# EAGLE design reversator (EAGLE 6.4)
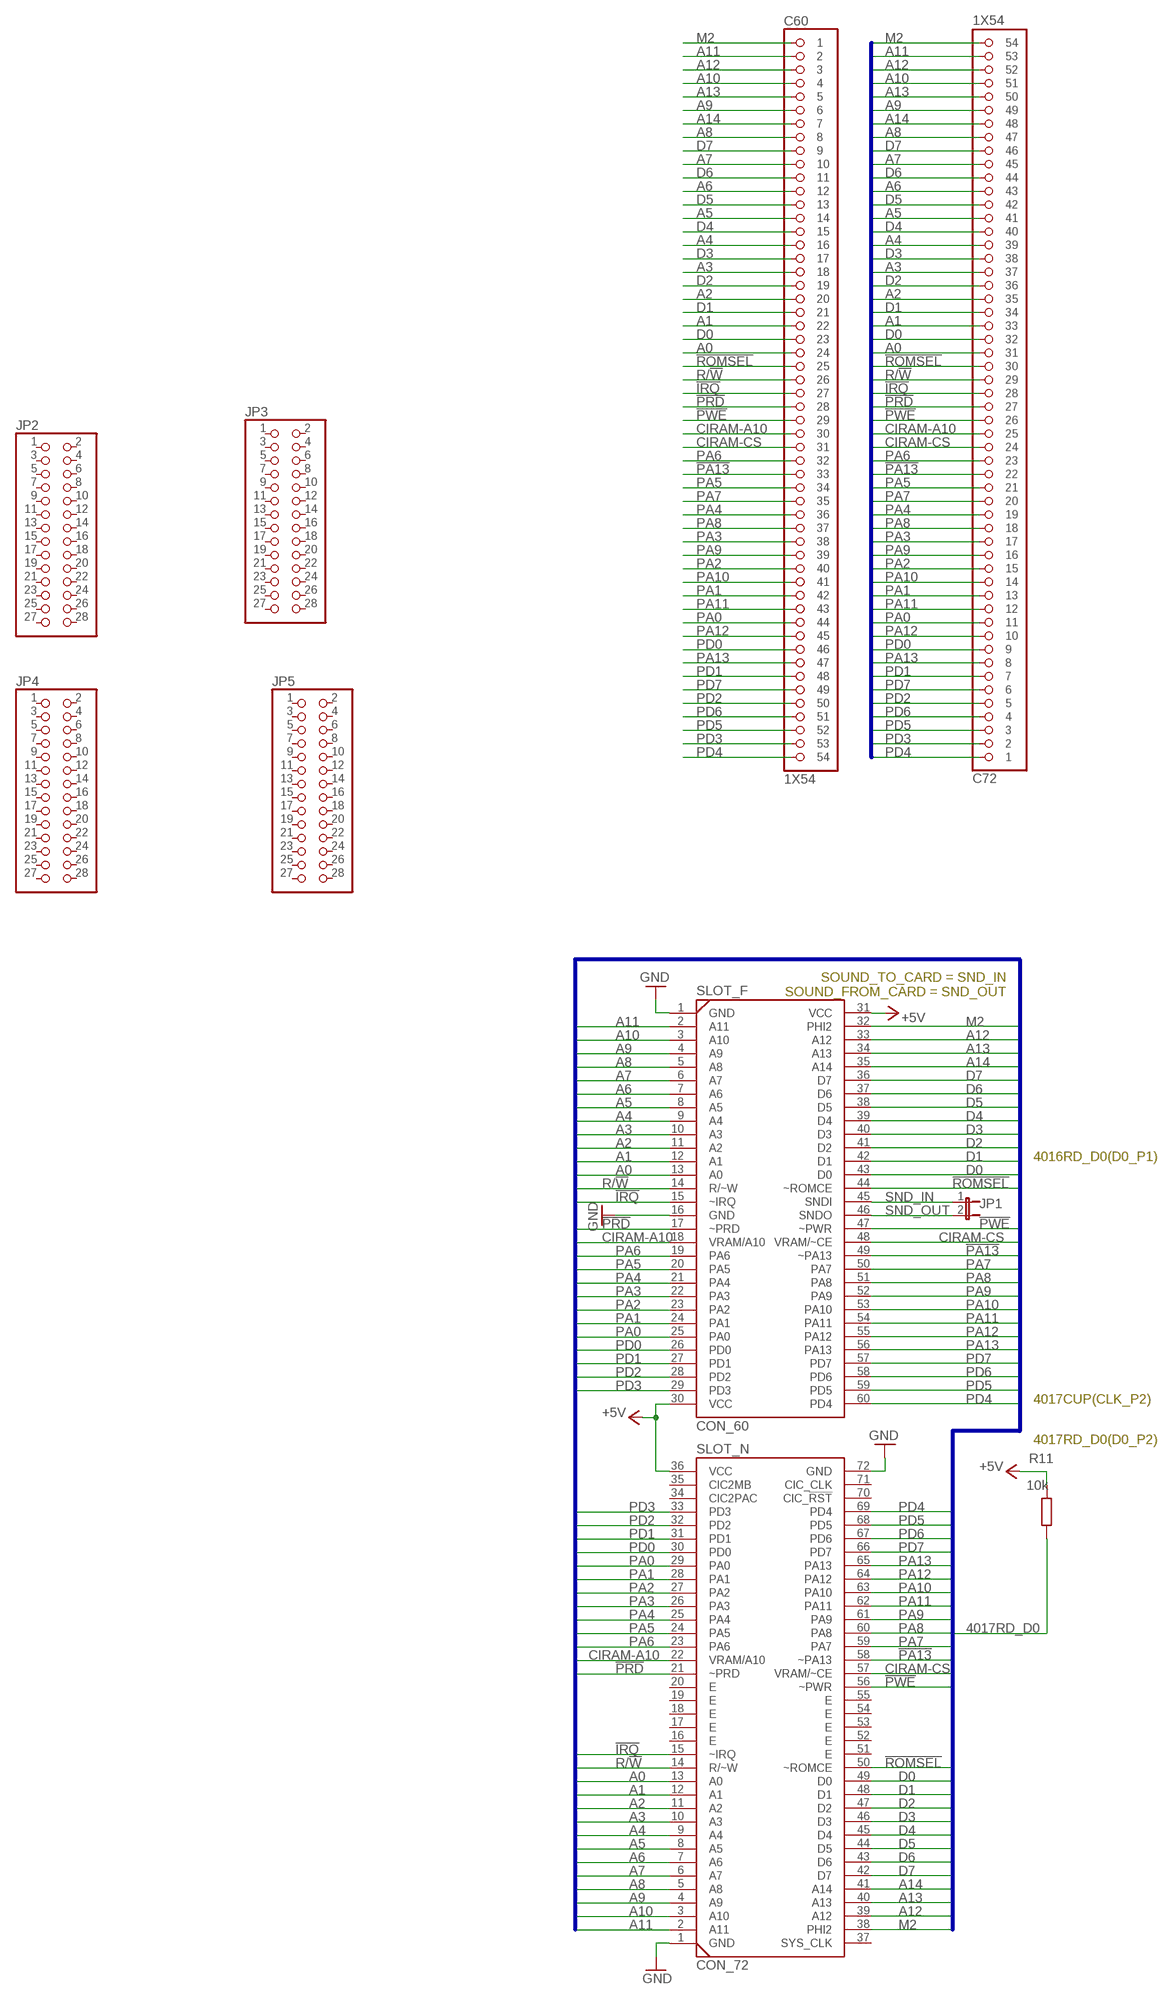
[diagram p0: schematic, sheet 1]

## Parts
C60  1X54  [1X54]
C72  1X54  [1X54]
JP1  JP1E  [JP1]
JP2  PINHD-2X14  [2X14]
JP3  PINHD-2X14  [2X14]
JP4  PINHD-2X14  [2X14]
JP5  PINHD-2X14  [2X14]
R11  10k  R-EU_M0805  [M0805]
SLOT_F  CON_60  [CON_60]
SLOT_N  CON_72  [CON_72]

## Nets
4017RD_D0: R11.2
!IRQ: C60.P$27 C72.P$28 SLOT_F.15(~IRQ) SLOT_N.15(~IRQ)
!PA13: C60.P$33 C72.P$22 SLOT_F.49(~PA13) SLOT_N.58(~PA13)
!PRD: C60.P$28 C72.P$27 SLOT_F.17(~PRD) SLOT_N.21(~PRD)
!PWE: C60.P$29 C72.P$26 SLOT_F.47(~PWR) SLOT_N.56(~PWR)
!ROMSEL: C60.P$25 C72.P$30 SLOT_F.44(~ROMCE) SLOT_N.50(~ROMCE)
+5V: R11.1 SLOT_F.30(VCC) SLOT_F.31(VCC) SLOT_N.36(VCC)
A0: C60.P$24 C72.P$31 SLOT_F.13(A0) SLOT_N.13(A0)
A1: C60.P$22 C72.P$33 SLOT_F.12(A1) SLOT_N.12(A1)
A2: C60.P$20 C72.P$35 SLOT_F.11(A2) SLOT_N.11(A2)
A3: C60.P$18 C72.P$37 SLOT_F.10(A3) SLOT_N.10(A3)
A4: C60.P$16 C72.P$39 SLOT_F.9(A4) SLOT_N.9(A4)
A5: C60.P$14 C72.P$41 SLOT_F.8(A5) SLOT_N.8(A5)
A6: C60.P$12 C72.P$43 SLOT_F.7(A6) SLOT_N.7(A6)
A7: C60.P$10 C72.P$45 SLOT_F.6(A7) SLOT_N.6(A7)
A8: C60.P$8 C72.P$47 SLOT_F.5(A8) SLOT_N.5(A8)
A9: C60.P$6 C72.P$49 SLOT_F.4(A9) SLOT_N.4(A9)
A10: C60.P$4 C72.P$51 SLOT_F.3(A10) SLOT_N.3(A10)
A11: C60.P$2 C72.P$53 SLOT_F.2(A11) SLOT_N.2(A11)
A12: C60.P$3 C72.P$52 SLOT_F.33(A12) SLOT_N.39(A12)
A13: C60.P$5 C72.P$50 SLOT_F.34(A13) SLOT_N.40(A13)
A14: C60.P$7 C72.P$48 SLOT_F.35(A14) SLOT_N.41(A14)
CIRAM-A10: C60.P$30 C72.P$25 SLOT_F.18(VRAM/A10) SLOT_N.22(VRAM/A10)
CIRAM-CS: C60.P$31 C72.P$24 SLOT_F.48(VRAM/~CE) SLOT_N.57(VRAM/~CE)
D0: C60.P$23 C72.P$32 SLOT_F.43(D0) SLOT_N.49(D0)
D1: C60.P$21 C72.P$34 SLOT_F.42(D1) SLOT_N.48(D1)
D2: C60.P$19 C72.P$36 SLOT_F.41(D2) SLOT_N.47(D2)
D3: C60.P$17 C72.P$38 SLOT_F.40(D3) SLOT_N.46(D3)
D4: C60.P$15 C72.P$40 SLOT_F.39(D4) SLOT_N.45(D4)
D5: C60.P$13 C72.P$42 SLOT_F.38(D5) SLOT_N.44(D5)
D6: C60.P$11 C72.P$44 SLOT_F.37(D6) SLOT_N.43(D6)
D7: C60.P$9 C72.P$46 SLOT_F.36(D7) SLOT_N.42(D7)
GND: SLOT_F.1(GND) SLOT_F.16(GND) SLOT_N.1(GND) SLOT_N.72(GND)
M2: C60.P$1 C72.P$54 SLOT_F.32(PHI2) SLOT_N.38(PHI2)
PA0: C60.P$44 C72.P$11 SLOT_F.25(PA0) SLOT_N.29(PA0)
PA1: C60.P$42 C72.P$13 SLOT_F.24(PA1) SLOT_N.28(PA1)
PA2: C60.P$40 C72.P$15 SLOT_F.23(PA2) SLOT_N.27(PA2)
PA3: C60.P$38 C72.P$17 SLOT_F.22(PA3) SLOT_N.26(PA3)
PA4: C60.P$36 C72.P$19 SLOT_F.21(PA4) SLOT_N.25(PA4)
PA5: C60.P$34 C72.P$21 SLOT_F.20(PA5) SLOT_N.24(PA5)
PA6: C60.P$32 C72.P$23 SLOT_F.19(PA6) SLOT_N.23(PA6)
PA7: C60.P$35 C72.P$20 SLOT_F.50(PA7) SLOT_N.59(PA7)
PA8: C60.P$37 C72.P$18 SLOT_F.51(PA8) SLOT_N.60(PA8)
PA9: C60.P$39 C72.P$16 SLOT_F.52(PA9) SLOT_N.61(PA9)
PA10: C60.P$41 C72.P$14 SLOT_F.53(PA10) SLOT_N.63(PA10)
PA11: C60.P$43 C72.P$12 SLOT_F.54(PA11) SLOT_N.62(PA11)
PA12: C60.P$45 C72.P$10 SLOT_F.55(PA12) SLOT_N.64(PA12)
PA13: C60.P$47 C72.P$8 SLOT_F.56(PA13) SLOT_N.65(PA13)
PD0: C60.P$46 C72.P$9 SLOT_F.26(PD0) SLOT_N.30(PD0)
PD1: C60.P$48 C72.P$7 SLOT_F.27(PD1) SLOT_N.31(PD1)
PD2: C60.P$50 C72.P$5 SLOT_F.28(PD2) SLOT_N.32(PD2)
PD3: C60.P$53 C72.P$2 SLOT_F.29(PD3) SLOT_N.33(PD3)
PD4: C60.P$54 C72.P$1 SLOT_F.60(PD4) SLOT_N.69(PD4)
PD5: C60.P$52 C72.P$3 SLOT_F.59(PD5) SLOT_N.68(PD5)
PD6: C60.P$51 C72.P$4 SLOT_F.58(PD6) SLOT_N.67(PD6)
PD7: C60.P$49 C72.P$6 SLOT_F.57(PD7) SLOT_N.66(PD7)
R/!W: C60.P$26 C72.P$29 SLOT_F.14(R/~W) SLOT_N.14(R/~W)
SND_IN: JP1.1 SLOT_F.45(SNDI)
SND_OUT: JP1.2 SLOT_F.46(SNDO)
Unconnected: JP2.1 JP2.2 JP2.3 JP2.4 JP2.5 JP2.6 JP2.7 JP2.8 JP2.9 JP2.10 JP2.11 JP2.12 JP2.13 JP2.14 JP2.15 JP2.16 JP2.17 JP2.18 JP2.19 JP2.20 JP2.21 JP2.22 JP2.23 JP2.24 JP2.25 JP2.26 JP2.27 JP2.28 JP3.1 JP3.2 JP3.3 JP3.4 JP3.5 JP3.6 JP3.7 JP3.8 JP3.9 JP3.10 JP3.11 JP3.12 JP3.13 JP3.14 JP3.15 JP3.16 JP3.17 JP3.18 JP3.19 JP3.20 JP3.21 JP3.22 JP3.23 JP3.24 JP3.25 JP3.26 JP3.27 JP3.28 JP4.1 JP4.2 JP4.3 JP4.4 JP4.5 JP4.6 JP4.7 JP4.8 JP4.9 JP4.10 JP4.11 JP4.12 JP4.13 JP4.14 JP4.15 JP4.16 JP4.17 JP4.18 JP4.19 JP4.20 JP4.21 JP4.22 JP4.23 JP4.24 JP4.25 JP4.26 JP4.27 JP4.28 JP5.1 JP5.2 JP5.3 JP5.4 JP5.5 JP5.6 JP5.7 JP5.8 JP5.9 JP5.10 JP5.11 JP5.12 JP5.13 JP5.14 JP5.15 JP5.16 JP5.17 JP5.18 JP5.19 JP5.20 JP5.21 JP5.22 JP5.23 JP5.24 JP5.25 JP5.26 JP5.27 JP5.28 SLOT_N.16(E) SLOT_N.17(E) SLOT_N.18(E) SLOT_N.19(E) SLOT_N.20(E) SLOT_N.34(CIC2PAC) SLOT_N.35(CIC2MB) SLOT_N.37(SYS_CLK) SLOT_N.51(E) SLOT_N.52(E) SLOT_N.53(E) SLOT_N.54(E) SLOT_N.55(E) SLOT_N.70(CIC_!RST) SLOT_N.71(CIC_CLK)

## Buses
A[0..15],D[0..7],PA[0..13],!PA13,PD[0..7],CLK21,CLK26,CLK_P21,CLK_P26,CIRAM-A10,CIRAM-CS,!IRQ,M2,!NMI,PALE,!PPU,!PRD,!PWE,!RAM,!ROMSEL,R/!W,!RST21,!RST26,!RST_P21,!RST_P26,4016CUP,4016RD_!OE,4016WR_B[0..2],4016RD_D[0..4],4017CUP,4017RD_!OE,4017RD_D[0..4],VIDEO21,VIDEO26,MIC,SND_IN,SND_OUT,SOUND21_[1..2],SOUND21,SOUND26_[1..2],SOUND26

## Notes on the sheet
- SOUND_TO_CARD = SND_IN
  SOUND_FROM_CARD = SND_OUT
- 4016RD_D0(D0_P1)
- 4017CUP(CLK_P2)
- 4017RD_D0(D0_P2)

## Library data of the parts
C60 C72 = h1,27mm:1X54
JP1 = jumper:JP1E: JUMPER
JP2-JP5 = Разъёмы штырьковые 2.54мм:PINHD-2X14: PIN HEADER
R11 = rcl:R-EU_: RESISTOR, European symbol
SLOT_F = con_nes:CON_60
SLOT_N = fc-nes:CON_72

## Board
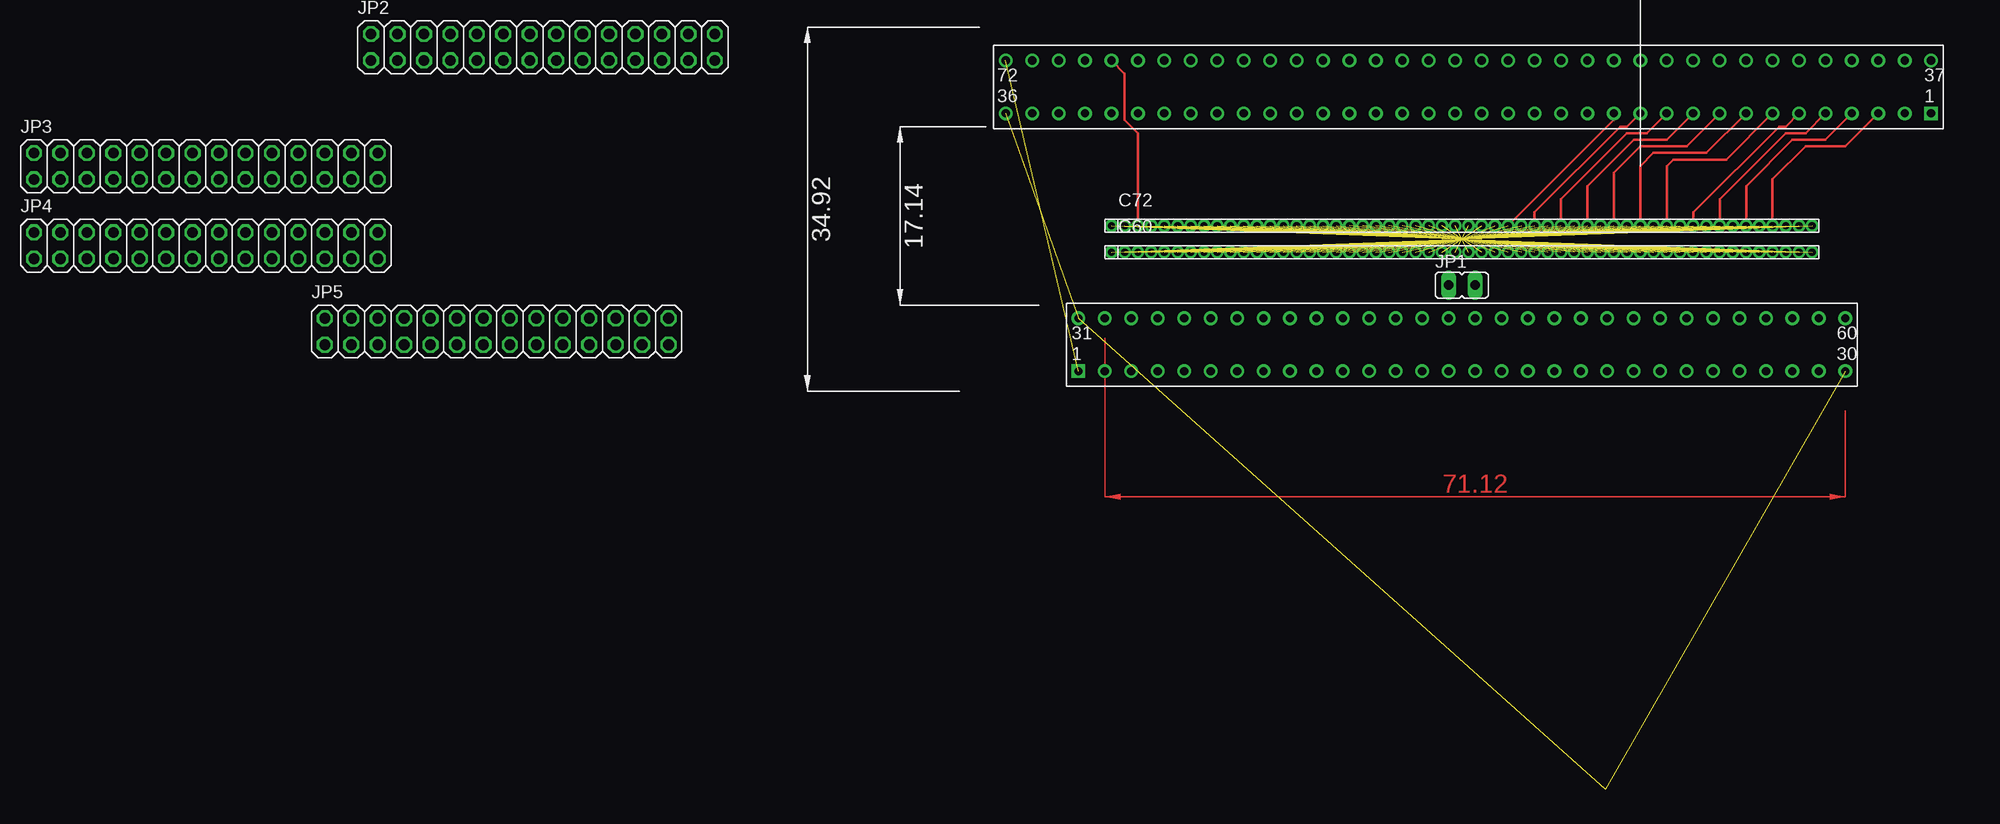
[diagram p1: board, top side]
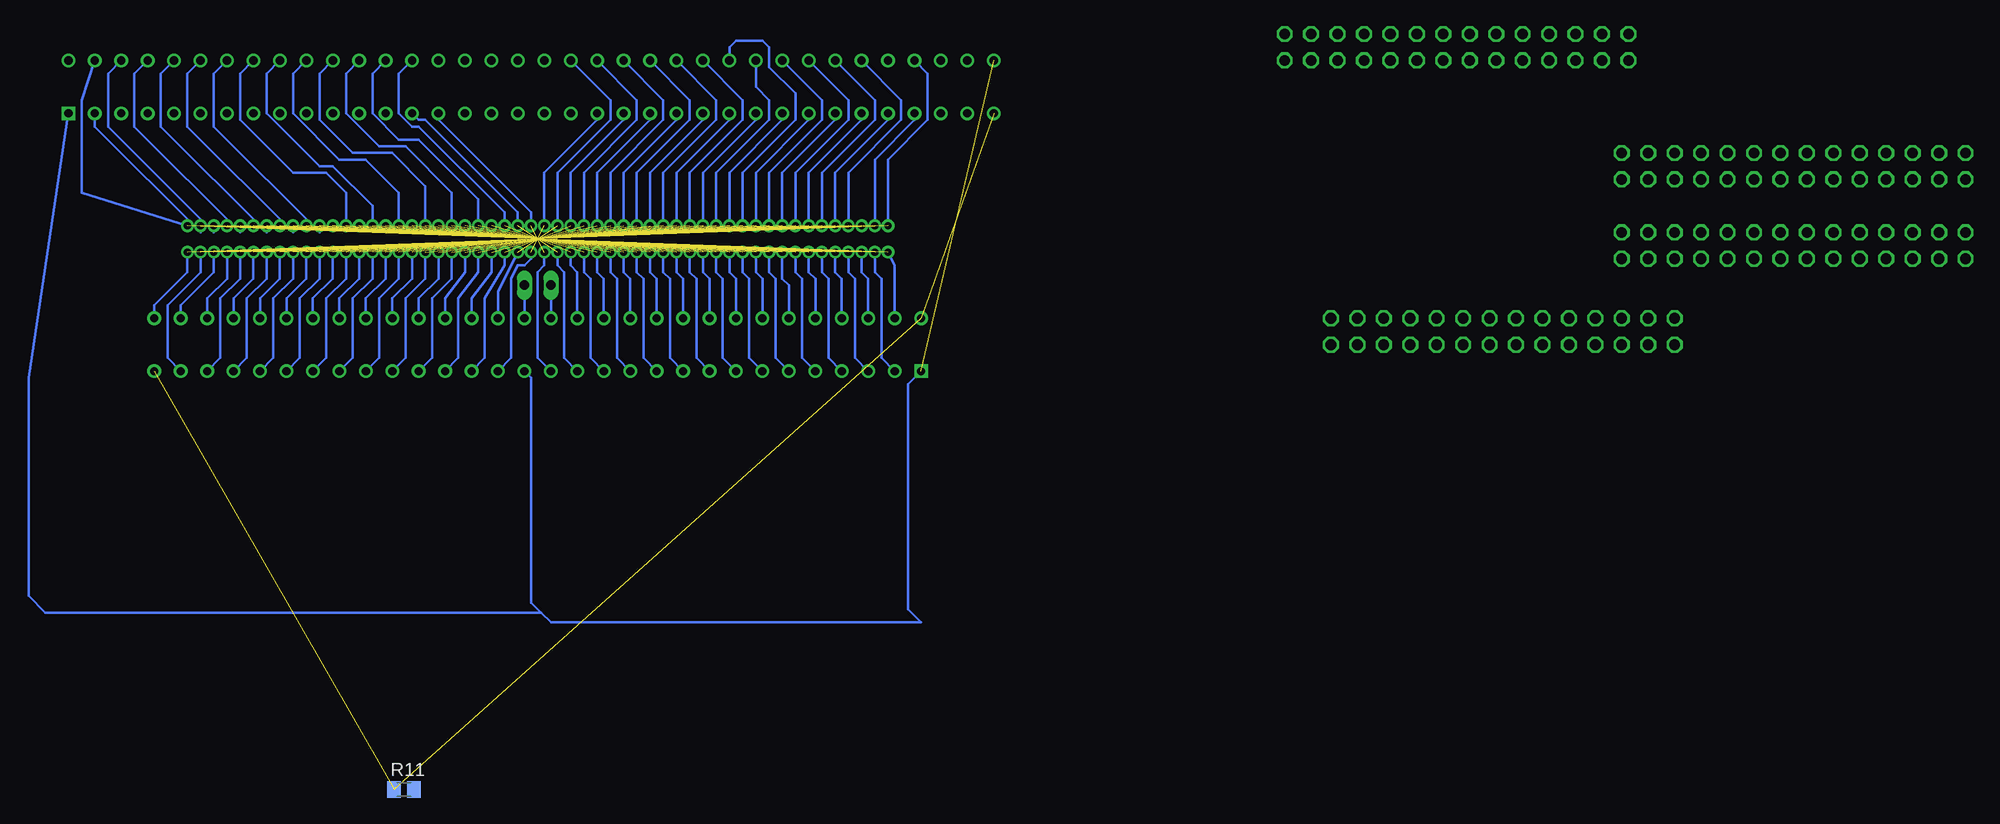
[diagram p2: board, bottom side, seen from below]

No outline drawn. Coordinates in mm, seen from the top.
Copper layers (1*16): Top 0.035mm / dielectric 1.5mm / Bottom 0.035mm
Design rules "default": minimum track width 0.2mm, minimum drill 24mil, track to track 0.2mm, track to pad 8mil, pad to pad 8mil, via to via 8mil, smd to smd 8mil, copper to edge 40mil, drill to drill 8mil, minimum pad ring 10mil, minimum via ring 8mil, stop-mask expansion 4mil, vias tented up to drill 0mil, thermal gap 10mil

### Footprints (pad centres in the part's own frame; a part is rotated, then mirrored left to right if it is on the bottom)
1X54 = drill 0.7 pad 1: P$1 -33.655,0; P$2 -32.385,0; P$3 -31.115,0; P$4 -29.845,0; P$5 -28.575,0; P$6 -27.305,0; P$7 -26.035,0; P$8 -24.765,0; P$9 -23.495,0; P$10 -22.225,0; P$11 -20.955,0; P$12 -19.685,0; P$13 -18.415,0; P$14 -17.145,0; P$15 -15.875,0; P$16 -14.605,0; P$17 -13.335,0; P$18 -12.065,0; P$19 -10.795,0; P$20 -9.525,0; P$21 -8.255,0; P$22 -6.985,0; P$23 -5.715,0; P$24 -4.445,0; P$25 -3.175,0; P$26 -1.905,0; P$27 -0.635,0; P$28 0.635,0; P$29 1.905,0; P$30 3.175,0; P$31 4.445,0; P$32 5.715,0; P$33 6.985,0; P$34 8.255,0; P$35 9.525,0; P$36 10.795,0; P$37 12.065,0; P$38 13.335,0; P$39 14.605,0; P$40 15.875,0; P$41 17.145,0; P$42 18.415,0; P$43 19.685,0; P$44 20.955,0; P$45 22.225,0; P$46 23.495,0; P$47 24.765,0; P$48 26.035,0; P$49 27.305,0; P$50 28.575,0; P$51 29.845,0; P$52 31.115,0; P$53 32.385,0; P$54 33.655,0
JP1 = drill 0.914 long: 1 0,-1.27; 2 0,1.27
2X14 = drill 1.016 octagon: 1 -16.51,-1.27; 2 -16.51,1.27; 3 -13.97,-1.27; 4 -13.97,1.27; 5 -11.43,-1.27; 6 -11.43,1.27; 7 -8.89,-1.27; 8 -8.89,1.27; 9 -6.35,-1.27; 10 -6.35,1.27; 11 -3.81,-1.27; 12 -3.81,1.27; 13 -1.27,-1.27; 14 -1.27,1.27; 15 1.27,-1.27; 16 1.27,1.27; 17 3.81,-1.27; 18 3.81,1.27; 19 6.35,-1.27; 20 6.35,1.27; 21 8.89,-1.27; 22 8.89,1.27; 23 11.43,-1.27; 24 11.43,1.27; 25 13.97,-1.27; 26 13.97,1.27; 27 16.51,-1.27; 28 16.51,1.27
M0805 = smd 1.3 x 1.6: 1 -0.95,0; 2 0.95,0
CON_60 = drill 0.8 square: 1 -36.83,-2.54 | drill 0.8: 2 -34.29,-2.54; 3 -31.75,-2.54; 4 -29.21,-2.54; 5 -26.67,-2.54; 6 -24.13,-2.54; 7 -21.59,-2.54; 8 -19.05,-2.54; 9 -16.51,-2.54; 10 -13.97,-2.54; 11 -11.43,-2.54; 12 -8.89,-2.54; 13 -6.35,-2.54; 14 -3.81,-2.54; 15 -1.27,-2.54; 16 1.27,-2.54; 17 3.81,-2.54; 18 6.35,-2.54; 19 8.89,-2.54; 20 11.43,-2.54; 21 13.97,-2.54; 22 16.51,-2.54; 23 19.05,-2.54; 24 21.59,-2.54; 25 24.13,-2.54; 26 26.67,-2.54; 27 29.21,-2.54; 28 31.75,-2.54; 29 34.29,-2.54; 30 36.83,-2.54; 31 -36.83,2.54; 32 -34.29,2.54; 33 -31.75,2.54; 34 -29.21,2.54; 35 -26.67,2.54; 36 -24.13,2.54; 37 -21.59,2.54; 38 -19.05,2.54; 39 -16.51,2.54; 40 -13.97,2.54; 41 -11.43,2.54; 42 -8.89,2.54; 43 -6.35,2.54; 44 -3.81,2.54; 45 -1.27,2.54; 46 1.27,2.54; 47 3.81,2.54; 48 6.35,2.54; 49 8.89,2.54; 50 11.43,2.54; 51 13.97,2.54; 52 16.51,2.54; 53 19.05,2.54; 54 21.59,2.54; 55 24.13,2.54; 56 26.67,2.54; 57 29.21,2.54; 58 31.75,2.54; 59 34.29,2.54; 60 36.83,2.54
CON_72 = drill 0.8 square: 1 44.45,-2.54 | drill 0.8: 2 41.91,-2.54; 3 39.37,-2.54; 4 36.83,-2.54; 5 34.29,-2.54; 6 31.75,-2.54; 7 29.21,-2.54; 8 26.67,-2.54; 9 24.13,-2.54; 10 21.59,-2.54; 11 19.05,-2.54; 12 16.51,-2.54; 13 13.97,-2.54; 14 11.43,-2.54; 15 8.89,-2.54; 16 6.35,-2.54; 17 3.81,-2.54; 18 1.27,-2.54; 19 -1.27,-2.54; 20 -3.81,-2.54; 21 -6.35,-2.54; 22 -8.89,-2.54; 23 -11.43,-2.54; 24 -13.97,-2.54; 25 -16.51,-2.54; 26 -19.05,-2.54; 27 -21.59,-2.54; 28 -24.13,-2.54; 29 -26.67,-2.54; 30 -29.21,-2.54; 31 -31.75,-2.54; 32 -34.29,-2.54; 33 -36.83,-2.54; 34 -39.37,-2.54; 35 -41.91,-2.54; 36 -44.45,-2.54; 37 44.45,2.54; 38 41.91,2.54; 39 39.37,2.54; 40 36.83,2.54; 41 34.29,2.54; 42 31.75,2.54; 43 29.21,2.54; 44 26.67,2.54; 45 24.13,2.54; 46 21.59,2.54; 47 19.05,2.54; 48 16.51,2.54; 49 13.97,2.54; 50 11.43,2.54; 51 8.89,2.54; 52 6.35,2.54; 53 3.81,2.54; 54 1.27,2.54; 55 -1.27,2.54; 56 -3.81,2.54; 57 -6.35,2.54; 58 -8.89,2.54; 59 -11.43,2.54; 60 -13.97,2.54; 61 -16.51,2.54; 62 -19.05,2.54; 63 -21.59,2.54; 64 -24.13,2.54; 65 -26.67,2.54; 66 -29.21,2.54; 67 -31.75,2.54; 68 -34.29,2.54; 69 -36.83,2.54; 70 -39.37,2.54; 71 -41.91,2.54; 72 -44.45,2.54

### Placement (x,y rotation side)
C60  0,24.13 0 top
C72  0,26.67 0 top
JP1  0,20.95 270 top
JP2  -88.27,43.81 0 top
JP3  -120.65,32.38 0 top
JP4  -120.65,24.77 0 top
JP5  -92.71,16.51 0 top
R11  12.86,-27.46 0 bottom
SLOT_F  0,15.24 0 top
SLOT_N  0.64,40.01 0 top

### Tracks (layer width: path | path; a pad name or v marks a point on that pad's centre or on a via)
!IRQ  (1 unrouted)
  Bottom 0.254: SLOT_F.15 0,13.97 0,22.23 -0.64,22.86 C60.P$27 | SLOT_N.15 9.53,36.83 0.64,27.94 C72.P$28
!PA13  (1 unrouted)
  Bottom 0.254: SLOT_F.49 8.89,19.68 6.99,22.23 C60.P$33 | SLOT_N.58 -12.06,38.73 -12.06,36.83 -6.99,31.75 C72.P$22
!PRD  (1 unrouted)
  Bottom 0.254: SLOT_F.17 2.54,13.97 2.54,21.59 1.91,22.86 1.27,22.86 0.64,23.5 C60.P$28 | SLOT_N.21 -5.71,36.83 -0.64,31.75 C72.P$27
!PWE  (1 unrouted)
  Bottom 0.254: SLOT_F.47 3.81,20.32 C60.P$29 | SLOT_N.56 -6.99,38.73 -6.99,36.83 -1.91,31.75 C72.P$26
!ROMSEL  (1 unrouted)
  Bottom 0.254: SLOT_F.44 -3.81,22.23 -3.17,22.86 C60.P$25 | C72.P$30 3.17,27.94 11.43,36.2 12.06,36.2 13.34,37.47 13.34,41.27 SLOT_N.50
+5V  (3 unrouted)
A0  (1 unrouted)
  Top 0.254: C72.P$31 14.61,36.83 SLOT_N.13
  Bottom 0.254: SLOT_F.13 -5.08,13.97 -5.08,21.59 -4.45,22.23 C60.P$24
A1  (1 unrouted)
  Top 0.254: C72.P$33 6.99,27.94 15.24,36.2 15.88,36.2 SLOT_N.12
  Bottom 0.254: SLOT_F.12 -7.62,13.97 -7.62,21.59 -6.99,22.23 C60.P$22
A2  (1 unrouted)
  Top 0.254: C72.P$35 9.53,29.21 15.88,35.56 17.78,35.56 SLOT_N.11
  Bottom 0.254: SLOT_F.11 -10.16,13.97 -10.16,21.59 -9.53,22.23 C60.P$20
A3  (1 unrouted)
  Top 0.254: C72.P$37 12.06,30.48 16.51,34.92 19.68,34.92 SLOT_N.10
  Bottom 0.254: SLOT_F.10 -12.7,13.97 -12.7,21.59 -12.06,22.23 C60.P$18
A4  (1 unrouted)
  Top 0.254: C72.P$39 14.61,31.75 17.14,34.29 21.59,34.29 SLOT_N.9
  Bottom 0.254: SLOT_F.9 -15.24,13.97 -15.24,21.59 -14.61,22.23 C60.P$16
A5  (1 unrouted)
  Top 0.254: C72.P$41 17.14,32.38 18.41,33.66 23.5,33.66 SLOT_N.8
  Bottom 0.254: SLOT_F.8 -17.78,13.97 -17.78,21.59 -17.14,22.23 C60.P$14
A6  (1 unrouted)
  Top 0.254: C72.P$43 19.68,32.38 20.32,33.02 25.4,33.02 SLOT_N.7
  Bottom 0.254: SLOT_F.7 -20.32,13.97 -20.32,21.59 -19.68,22.23 C60.P$12
A7  (1 unrouted)
  Top 0.254: C72.P$45 22.23,27.94 30.48,36.2 31.11,36.2 SLOT_N.6
  Bottom 0.254: SLOT_F.6 -22.86,13.97 -22.86,21.59 -22.23,22.23 C60.P$10
A8  (1 unrouted)
  Top 0.254: C72.P$47 24.77,29.21 31.11,35.56 33.02,35.56 SLOT_N.5
  Bottom 0.254: SLOT_F.5 -25.4,13.97 -25.4,21.59 -24.77,22.23 C60.P$8
A9  (1 unrouted)
  Top 0.254: C72.P$49 27.3,30.48 31.75,34.92 34.92,34.92 SLOT_N.4
  Bottom 0.254: SLOT_F.4 -27.94,13.97 -27.94,21.59 -27.3,22.23 C60.P$6
A10  (1 unrouted)
  Top 0.254: C72.P$51 29.84,31.11 33.02,34.29 36.83,34.29 SLOT_N.3
  Bottom 0.254: SLOT_F.3 -30.48,13.97 -30.48,21.59 -29.84,22.23 C60.P$4
A11  (1 unrouted)
  Bottom 0.254: SLOT_F.2 -33.02,13.97 -33.02,21.59 -32.38,22.23 C60.P$2 | C72.P$53 32.38,26.04 42.55,36.2 SLOT_N.2
A12  (1 unrouted)
  Bottom 0.254: SLOT_F.33 -31.75,21.59 -31.11,22.23 C60.P$3 | SLOT_N.39 41.27,41.27 41.27,36.2 31.11,26.04 C72.P$52
A13  (1 unrouted)
  Bottom 0.254: SLOT_F.34 -29.21,21.59 -28.57,22.23 C60.P$5 | SLOT_N.40 38.73,41.27 38.73,36.2 28.57,26.04 C72.P$50
A14  (1 unrouted)
  Bottom 0.254: SLOT_F.35 -26.67,21.59 -26.04,22.23 C60.P$7 | SLOT_N.41 36.2,41.27 36.2,36.2 26.04,26.04 C72.P$48
CIRAM-A10  (1 unrouted)
  Bottom 0.254: SLOT_F.18 5.08,13.97 5.08,19.68 3.17,22.86 C60.P$30 | SLOT_N.22 -8.26,36.83 -3.17,31.75 C72.P$25
CIRAM-CS  (1 unrouted)
  Bottom 0.254: SLOT_F.48 6.35,19.68 4.45,22.23 C60.P$31 | SLOT_N.57 -9.53,38.73 -9.53,36.83 -4.45,31.75 C72.P$24
D0  (1 unrouted)
  Bottom 0.254: SLOT_F.43 -6.35,21.59 -5.71,22.23 C60.P$23 | C72.P$32 5.71,29.21 11.43,34.92 13.34,34.92 15.88,37.47 15.88,41.27 SLOT_N.49
D1  (1 unrouted)
  Bottom 0.254: SLOT_F.42 -8.89,21.59 -8.26,22.23 C60.P$21 | C72.P$34 8.26,29.84 12.7,34.29 15.24,34.29 18.41,37.47 18.41,41.27 SLOT_N.48
D2  (1 unrouted)
  Bottom 0.254: SLOT_F.41 -11.43,21.59 -10.79,22.23 C60.P$19 | C72.P$36 10.79,30.48 13.97,33.66 17.78,33.66 20.95,36.83 20.95,41.27 SLOT_N.47
D3  (1 unrouted)
  Bottom 0.254: SLOT_F.40 -13.97,21.59 -13.34,22.23 C60.P$17 | C72.P$38 13.34,29.84 16.51,33.02 19.05,33.02 23.5,37.47 23.5,41.27 SLOT_N.46
D4  (1 unrouted)
  Bottom 0.254: SLOT_F.39 -16.51,21.59 -15.88,22.23 C60.P$15 | C72.P$40 15.88,28.57 19.68,32.38 20.95,32.38 26.04,37.47 26.04,41.27 SLOT_N.45
D5  (1 unrouted)
  Bottom 0.254: SLOT_F.38 -19.05,21.59 -18.41,22.23 C60.P$13 | C72.P$42 18.41,29.84 20.32,31.75 23.5,31.75 28.57,36.83 28.57,41.27 SLOT_N.44
D6  (1 unrouted)
  Bottom 0.254: SLOT_F.37 -21.59,21.59 -20.95,22.23 C60.P$11 | SLOT_N.43 31.11,41.27 31.11,36.2 20.95,26.04 C72.P$44
D7  (1 unrouted)
  Bottom 0.254: SLOT_F.36 -24.13,20.95 -23.5,21.59 C60.P$9 | SLOT_N.42 33.66,41.27 33.66,36.2 23.5,26.04 C72.P$46
GND  (1 unrouted)
  Bottom 0.254: SLOT_F.1 -35.56,11.43 -35.56,-10.16 -36.83,-11.43 -1.27,-11.43 -0.32,-10.48 | SLOT_F.16 0.64,12.06 0.64,-9.53 -0.32,-10.48 | SLOT_N.1 48.9,12.06 48.9,-8.89 47.31,-10.48 -0.32,-10.48
M2  (1 unrouted)
  Bottom 0.254: SLOT_F.32 -34.29,22.86 C60.P$1 | C72.P$54 43.81,29.84 43.81,38.73 SLOT_N.38
PA0  (1 unrouted)
  Bottom 0.254: SLOT_F.25 22.86,13.97 22.86,19.68 20.95,21.59 C60.P$44 | C72.P$11 -20.95,31.75 -26.04,36.83 SLOT_N.29
PA1  (1 unrouted)
  Bottom 0.254: SLOT_F.24 20.32,13.97 20.32,19.68 18.41,21.59 C60.P$42 | C72.P$13 -18.41,31.75 -23.5,36.83 SLOT_N.28
PA2  (1 unrouted)
  Bottom 0.254: SLOT_F.23 17.78,13.97 17.78,19.68 15.88,21.59 C60.P$40 | C72.P$15 -15.88,31.75 -20.95,36.83 SLOT_N.27
PA3  (1 unrouted)
  Bottom 0.254: SLOT_F.22 15.24,13.97 15.24,19.68 13.34,21.59 C60.P$38 | C72.P$17 -13.34,31.75 -18.41,36.83 SLOT_N.26
PA4  (1 unrouted)
  Bottom 0.254: SLOT_F.21 12.7,13.97 12.7,19.68 10.79,21.59 C60.P$36 | C72.P$19 -10.79,31.75 -15.88,36.83 SLOT_N.25
PA5  (1 unrouted)
  Bottom 0.254: C60.P$34 8.26,21.59 10.16,19.68 10.16,13.97 SLOT_F.20 | C72.P$21 -8.26,31.75 -13.34,36.83 SLOT_N.24
PA6  (1 unrouted)
  Bottom 0.254: C60.P$32 5.71,22.23 7.62,19.68 7.62,13.97 SLOT_F.19 | SLOT_N.23 -10.79,36.83 -5.71,31.75 C72.P$23
PA7  (1 unrouted)
  Bottom 0.254: SLOT_F.50 11.43,19.68 9.53,21.59 C60.P$35 | SLOT_N.59 -14.61,38.73 -14.61,36.83 -9.53,31.75 C72.P$20
PA8  (1 unrouted)
  Bottom 0.254: SLOT_F.51 13.97,19.68 12.06,21.59 C60.P$37 | SLOT_N.60 -17.14,38.73 -17.14,36.83 -12.06,31.75 C72.P$18
PA9  (1 unrouted)
  Bottom 0.254: SLOT_F.52 16.51,19.68 14.61,21.59 C60.P$39 | SLOT_N.61 -19.68,38.73 -19.68,36.83 -14.61,31.75 C72.P$16
PA10  (1 unrouted)
  Bottom 0.254: SLOT_F.53 19.05,19.68 17.14,21.59 C60.P$41 | SLOT_N.63 -20.95,40.01 -22.23,38.73 -22.23,36.83 -17.14,31.75 C72.P$14
PA11  (1 unrouted)
  Bottom 0.254: SLOT_F.54 21.59,19.68 19.68,21.59 C60.P$43 | SLOT_N.62 -18.41,43.81 -19.05,44.45 -21.59,44.45 -22.23,43.81 -22.23,41.91 -24.77,39.37 -24.77,36.83 -19.68,31.75 C72.P$12
PA12  (1 unrouted)
  Bottom 0.254: SLOT_F.55 24.13,19.68 22.23,21.59 C60.P$45 | C72.P$10 -22.23,31.75 -27.3,36.83 -27.3,38.73 SLOT_N.64
PA13  (1 unrouted)
  Bottom 0.254: SLOT_F.56 26.67,19.68 24.77,21.59 C60.P$47 | C72.P$8 -24.77,31.75 -29.84,36.83 -29.84,38.73 SLOT_N.65
PD0  (1 unrouted)
  Bottom 0.254: SLOT_F.26 25.4,13.97 25.4,19.68 23.5,21.59 C60.P$46 | C72.P$9 -23.5,31.75 -28.57,36.83 SLOT_N.30
PD1  (1 unrouted)
  Bottom 0.254: SLOT_F.27 27.94,13.97 27.94,19.68 26.04,21.59 C60.P$48 | C72.P$7 -26.04,31.75 -31.11,36.83 SLOT_N.31
PD2  (1 unrouted)
  Bottom 0.254: SLOT_F.28 30.48,13.97 30.48,19.68 28.57,21.59 C60.P$50 | C72.P$5 -28.57,31.75 -33.66,36.83 SLOT_N.32
PD3  (1 unrouted)
  Bottom 0.254: SLOT_F.29 35.56,13.97 35.56,19.05 32.38,22.23 C60.P$53 | C72.P$2 -32.38,33.02 -36.2,36.83 SLOT_N.33
PD4  (1 unrouted)
  Bottom 0.254: SLOT_F.60 36.83,19.05 33.66,22.23 C60.P$54 | C72.P$1 -33.66,33.02 -37.47,36.83 -37.47,41.27 SLOT_N.69
PD5  (1 unrouted)
  Top 0.254: C72.P$3 -31.11,35.56 -32.38,36.83 -32.38,41.27 SLOT_N.68
  Bottom 0.254: SLOT_F.59 34.29,19.05 31.11,22.23 C60.P$52
PD6  (1 unrouted)
  Bottom 0.254: SLOT_F.58 31.75,19.68 29.84,21.59 C60.P$51 | C72.P$4 -29.84,31.75 -34.92,36.83 -34.92,38.73 SLOT_N.67
PD7  (1 unrouted)
  Bottom 0.254: SLOT_F.57 29.21,19.68 27.3,21.59 C60.P$49 | C72.P$6 -27.3,31.75 -32.38,36.83 -32.38,38.73 SLOT_N.66
R/!W  (1 unrouted)
  Bottom 0.254: SLOT_F.14 -2.54,13.97 -2.54,22.23 -1.91,22.86 C60.P$26 | C72.P$29 1.91,27.94 10.79,36.83 11.43,36.83 SLOT_N.14
SND_IN
  Bottom 0.254: SLOT_F.45 JP1.1
SND_OUT
  Bottom 0.254: SLOT_F.46 JP1.2
(copper drawn outside any net)
  shapes: Top area x1